# Altium schematic sheet OvercurrentDetection.SchDoc
size A4; SheetNumber: 7; SheetTotal: 7
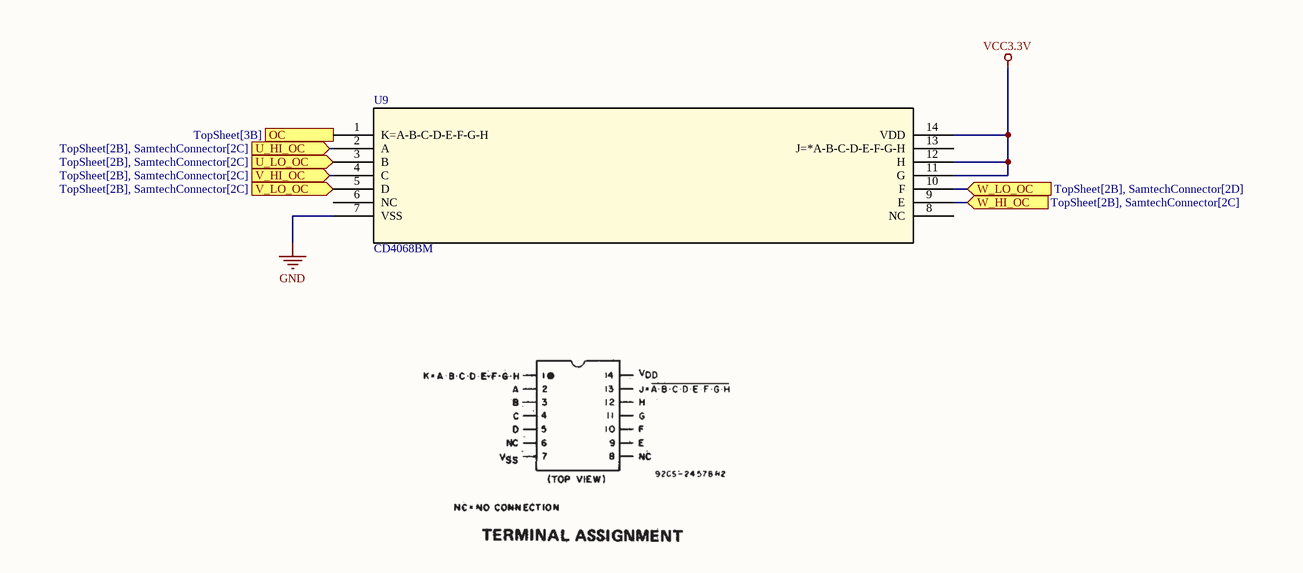
[diagram p0: OvercurrentDetection.SchDoc]

## Parts
U9  CD4068BM  [D14]

## Ports
OC (out, see TopSheet[3B]), U_HI_OC (in, see TopSheet[2B], SamtechConnector[2C]), U_LO_OC (in, see TopSheet[2B], SamtechConnector[2C]), V_HI_OC (in, see TopSheet[2B], SamtechConnector[2C]), V_LO_OC (in, see TopSheet[2B], SamtechConnector[2C]), W_HI_OC (in, see TopSheet[2B], SamtechConnector[2C]), W_LO_OC (in, see TopSheet[2B], SamtechConnector[2D])

## Nets
GND: U9.7(VSS)
VCC3.3V: U9.11(G) U9.12(H) U9.14(VDD)
OC: U9.1(K=A-B-C-D-E-F-G-H) ; port OC
U_HI_OC: U9.2(A) ; port U_HI_OC
U_LO_OC: U9.3(B) ; port U_LO_OC
V_HI_OC: U9.4(C) ; port V_HI_OC
V_LO_OC: U9.5(D) ; port V_LO_OC
W_HI_OC: U9.9(E) ; port W_HI_OC
W_LO_OC: U9.10(F) ; port W_LO_OC

Not connected (* = marked no-connect by the designer): U9 6(NC) 8(NC) 13(J=*A-B-C-D-E-F-G-H)

## Library data of the parts
U9 = CMP-023-000000-1: No Description Available; Mfr_Name: Texas Instruments; Type: Type; Source: CD4068BM.SchLib; Design Item ID: CD4068BM; RefDes: RefDes